# Altium schematic sheet RaceDAQ_ANALOG.SchDoc
size A4; SheetNumber: 3; SheetTotal: 4
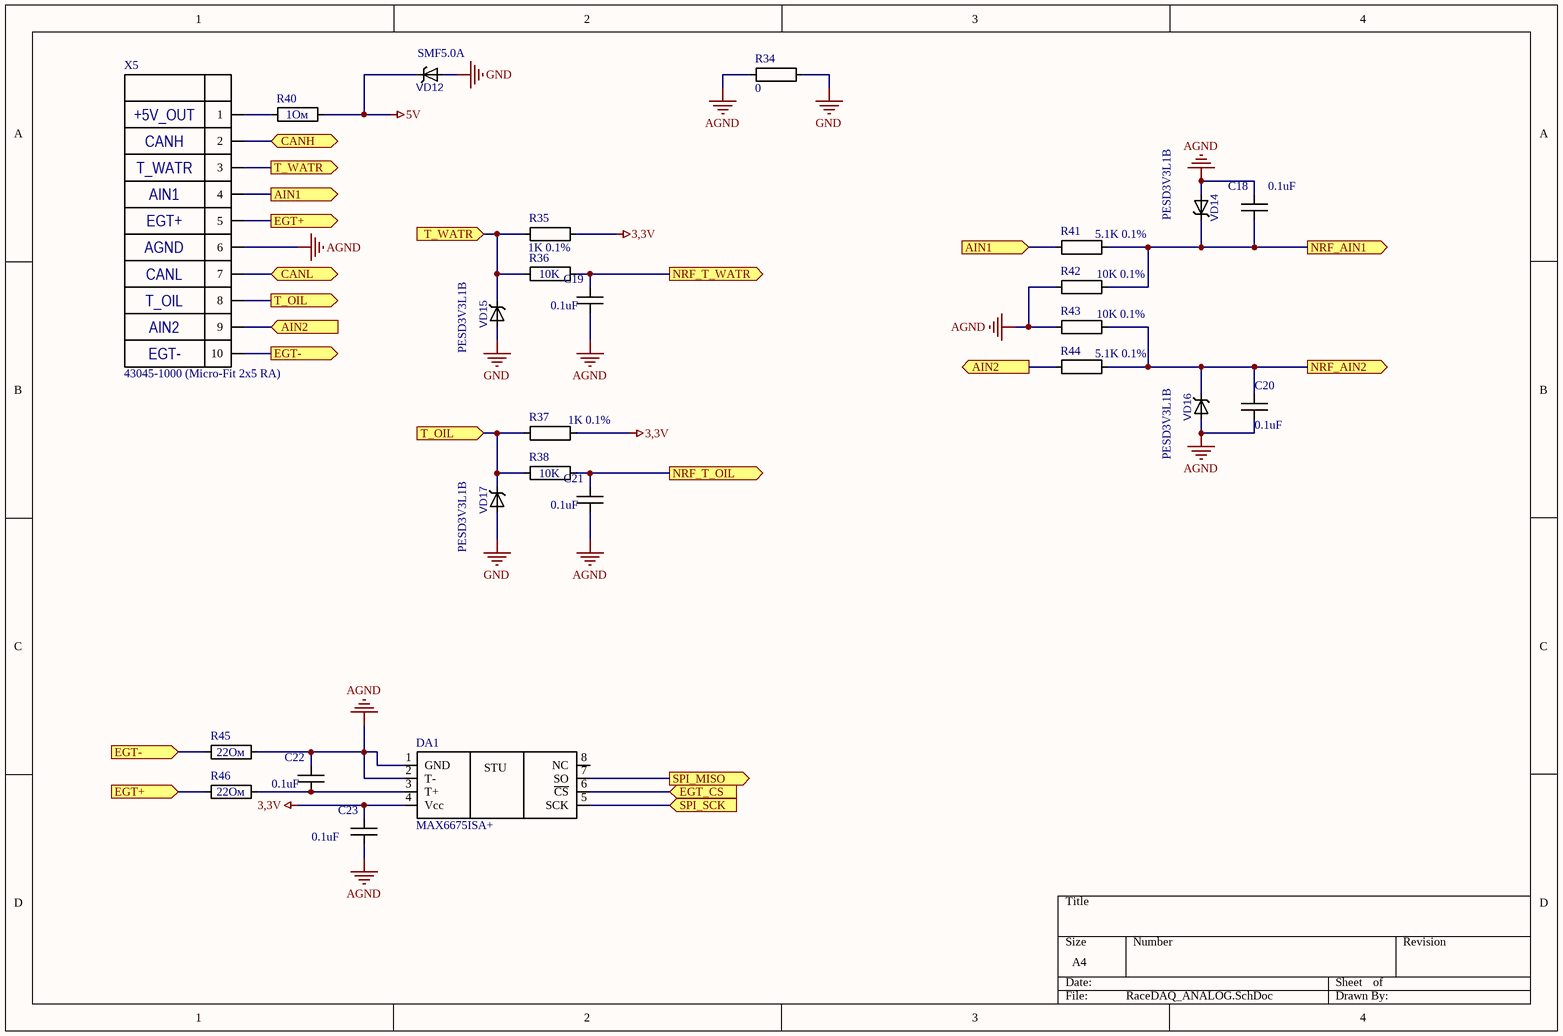
[diagram p0: RaceDAQ_ANALOG.SchDoc]

## Parts
C18  0.1uF  [CAPC1608X90L25N]
C19  0.1uF  [CAPC1608X90L25N]
C20  0.1uF  [CAPC1608X90L25N]
C21  0.1uF  [CAPC1608X90L25N]
C22  0.1uF  [CAPC1608X90L25N]
C23  0.1uF  [CAPC1608X90L25N]
DA1  MAX6675ISA+  [SOIC127P600X175-8L87N]
R34  0  [RESC2012X60L35N]
R35  1K 0.1%  [RESC1608X55L25N]
R36  10K  [RESC2012X60L35N]
R37  1K 0.1%  [RESC1608X55L25N]
R38  10K  [RESC2012X60L35N]
R40  1Ом  [RESC1608X55L25N]
R41  5.1K 0.1%  [RESC1608X55L25N]
R42  10K 0.1%  [RESC1608X55L25N]
R43  10K 0.1%  [RESC1608X55L25N]
R44  5.1K 0.1%  [RESC1608X55L25N]
R45  22Ом  [RESC1608X55L25N]
R46  22Ом  [RESC1608X55L25N]
VD12  SMF5.0A  [SODFL3617X110]
VD14  PESD3V3L1B  [SODFL1608X65N]
VD15  PESD3V3L1B  [SODFL1608X65N]
VD16  PESD3V3L1B  [SODFL1608X65N]
VD17  PESD3V3L1B  [SODFL1608X65N]
X5  43045-1000 (Micro-Fit 2x5 RA)  [43045-1000]

## Ports
AIN1 (in), AIN1 (out), AIN2 (in), AIN2 (out), CANH (bidir), CANL (bidir), EGT+ (in), EGT+ (out), EGT- (in), EGT- (out), EGT_CS (in), NRF_AIN1 (out), NRF_AIN2 (out), NRF_T_OIL (out), NRF_T_WATR (out), SPI_MISO (out), SPI_SCK (in), T_OIL (in), T_OIL (out), T_WATR (in), T_WATR (out)

## Nets
3,3V: C23.2 DA1.4(Vcc) R35.2 R37.2
5V: R40.2 VD12.C
AGND: C18.2 C19.1 C20.1 C21.1 C22.2 C23.1 DA1.1(GND) DA1.2(T-) R34.2 R42.1 R43.1 R45.2 VD14.A VD16.A X5.6
GND: R34.1 VD12.A VD15.A VD17.A
AIN1: R41.1 X5.4 ; port AIN1
AIN2: R44.1 X5.9 ; port AIN2
CANH: X5.2 ; port CANH
CANL: X5.7 ; port CANL
EGT+: R46.1 X5.5 ; port EGT+
EGT-: R45.1 X5.10 ; port EGT-
EGT_CS: DA1.6(~{CS}) ; port EGT_CS
NRF_AIN1: C18.1 R41.2 R42.2 VD14.C ; port NRF_AIN1
NRF_AIN2: C20.2 R43.2 R44.2 VD16.C ; port NRF_AIN2
NRF_T_OIL: C21.2 R38.2 ; port NRF_T_OIL
NRF_T_WATR: C19.2 R36.2 ; port NRF_T_WATR
SPI_MISO: DA1.7(SO) ; port SPI_MISO
SPI_SCK: DA1.5(SCK) ; port SPI_SCK
T_OIL: R37.1 R38.1 VD17.C X5.8 ; port T_OIL
T_WATR: R35.1 R36.1 VD15.C X5.3 ; port T_WATR
NetC22_1: C22.1 DA1.3(T+) R46.2
NetR40_1: R40.1 X5.1

Not connected (* = marked no-connect by the designer): DA1 8(NC)

## Notes on the sheet
- (near X5) +5V_OUT
- (near X5) CANH
- (near X5) T_WATR
- (near X5) AIN1
- (near X5) EGT+
- (near X5) AGND
- (near X5) CANL
- (near X5) T_OIL
- (near X5) AIN2
- (near X5) EGT-
- (in symbol MAX6675ISA+) STU

## Library data of the parts
C18-C23 = C0603: PartNumber: CL10B104KB8NNNC; Type: C0603; Voltage: 50V; Value: 0.1uF
R34 R36 R38 = R0805: Type: R0805
  R34: Value: 0
  R36 R38: Value: 10K
R35 R37 R40 = R0603: PartNumber: RT0603BRD071KL; Type: R0603
  R35 R37: Value: 1K 0.1%
  R40: Value: 1Ом
R41 R44 = R0603: PartNumber: RT0603BRD075K1L; Type: R0603; Value: 5.1K 0.1%
R42 R43 = R0603: PartNumber: RT0603BRD0710KL; Type: R0603; Value: 10K 0.1%
R45 R46 = R0603: Type: R0603; Value: 22Ом
VD12 = SMFxxA: Type: SMFxxA; Value: SMF5.0A
VD14-VD17 = PESDxS1UB: Type: PESDxS1UB; Value: PESD3V3L1B
X5 = 43045-1000: Type: 43045-1000; Value: 43045-1000 (Micro-Fit 2x5 RA)
DA1 = MAX6675ISA+: Type: MAX6675ISA+; Value: MAX6675ISA+